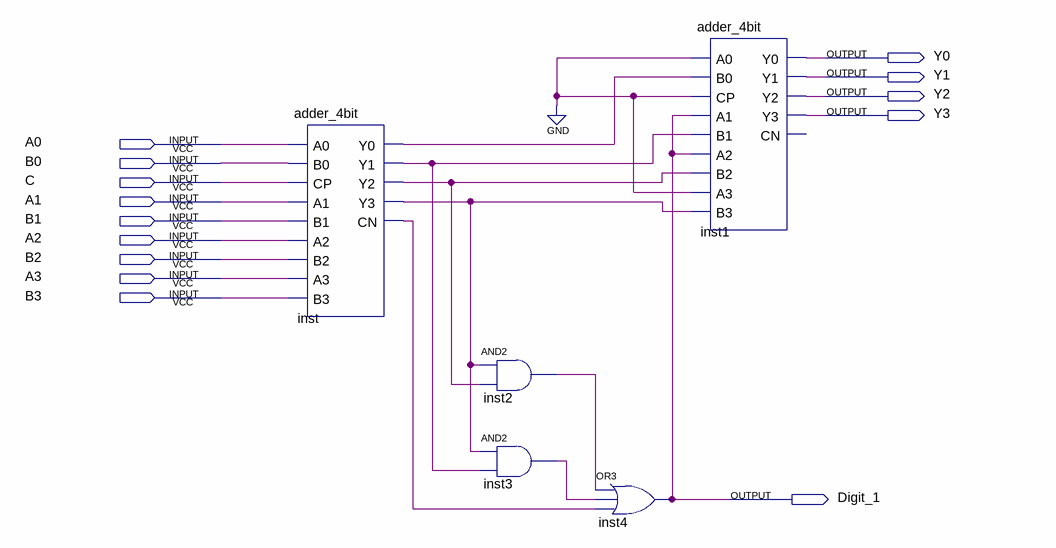
[diagram p0: schematic sheet]
// Quartus schematic bcd_adder.bdf as structural Verilog: 5 symbols, 14 pins
module bcd_adder (
  input  A0,
  input  B0,
  input  C,
  input  A1,
  input  B1,
  input  A2,
  input  B2,
  input  A3,
  input  B3,
  output Y0,
  output Y1,
  output Y2,
  output Y3,
  output Digit_1
);

  wire inst2_out, inst3_out, inst_cn, inst_y0, inst_y1, inst_y2, inst_y3;

  adder_4bit inst (
    .A0(A0), .B0(B0), .CP(C), .A1(A1), .B1(B1), .A2(A2), .B2(B2), .A3(A3), .B3(B3), .Y0(inst_y0),
    .Y1(inst_y1), .Y2(inst_y2), .Y3(inst_y3), .CN(inst_cn));
  and inst2 (inst2_out, inst_y3, inst_y2);
  and inst3 (inst3_out, inst_y3, inst_y1);
  or inst4 (Digit_1, inst2_out, inst3_out, inst_cn);
  adder_4bit inst1 (
    .A0(1'b0), .B0(inst_y0), .CP(1'b0), .A1(Digit_1), .B1(inst_y1), .A2(Digit_1), .B2(inst_y2), .A3(1'b0),
    .B3(inst_y3), .Y0(Y0), .Y1(Y1), .Y2(Y2), .Y3(Y3));  // open: CN
endmodule
